# Altium project merged_project.PrjPcb (part 2 of 3)

## Sheet PCB_USB_UART.SchDoc
size A2; SheetNumber: 2; SheetTotal: 3
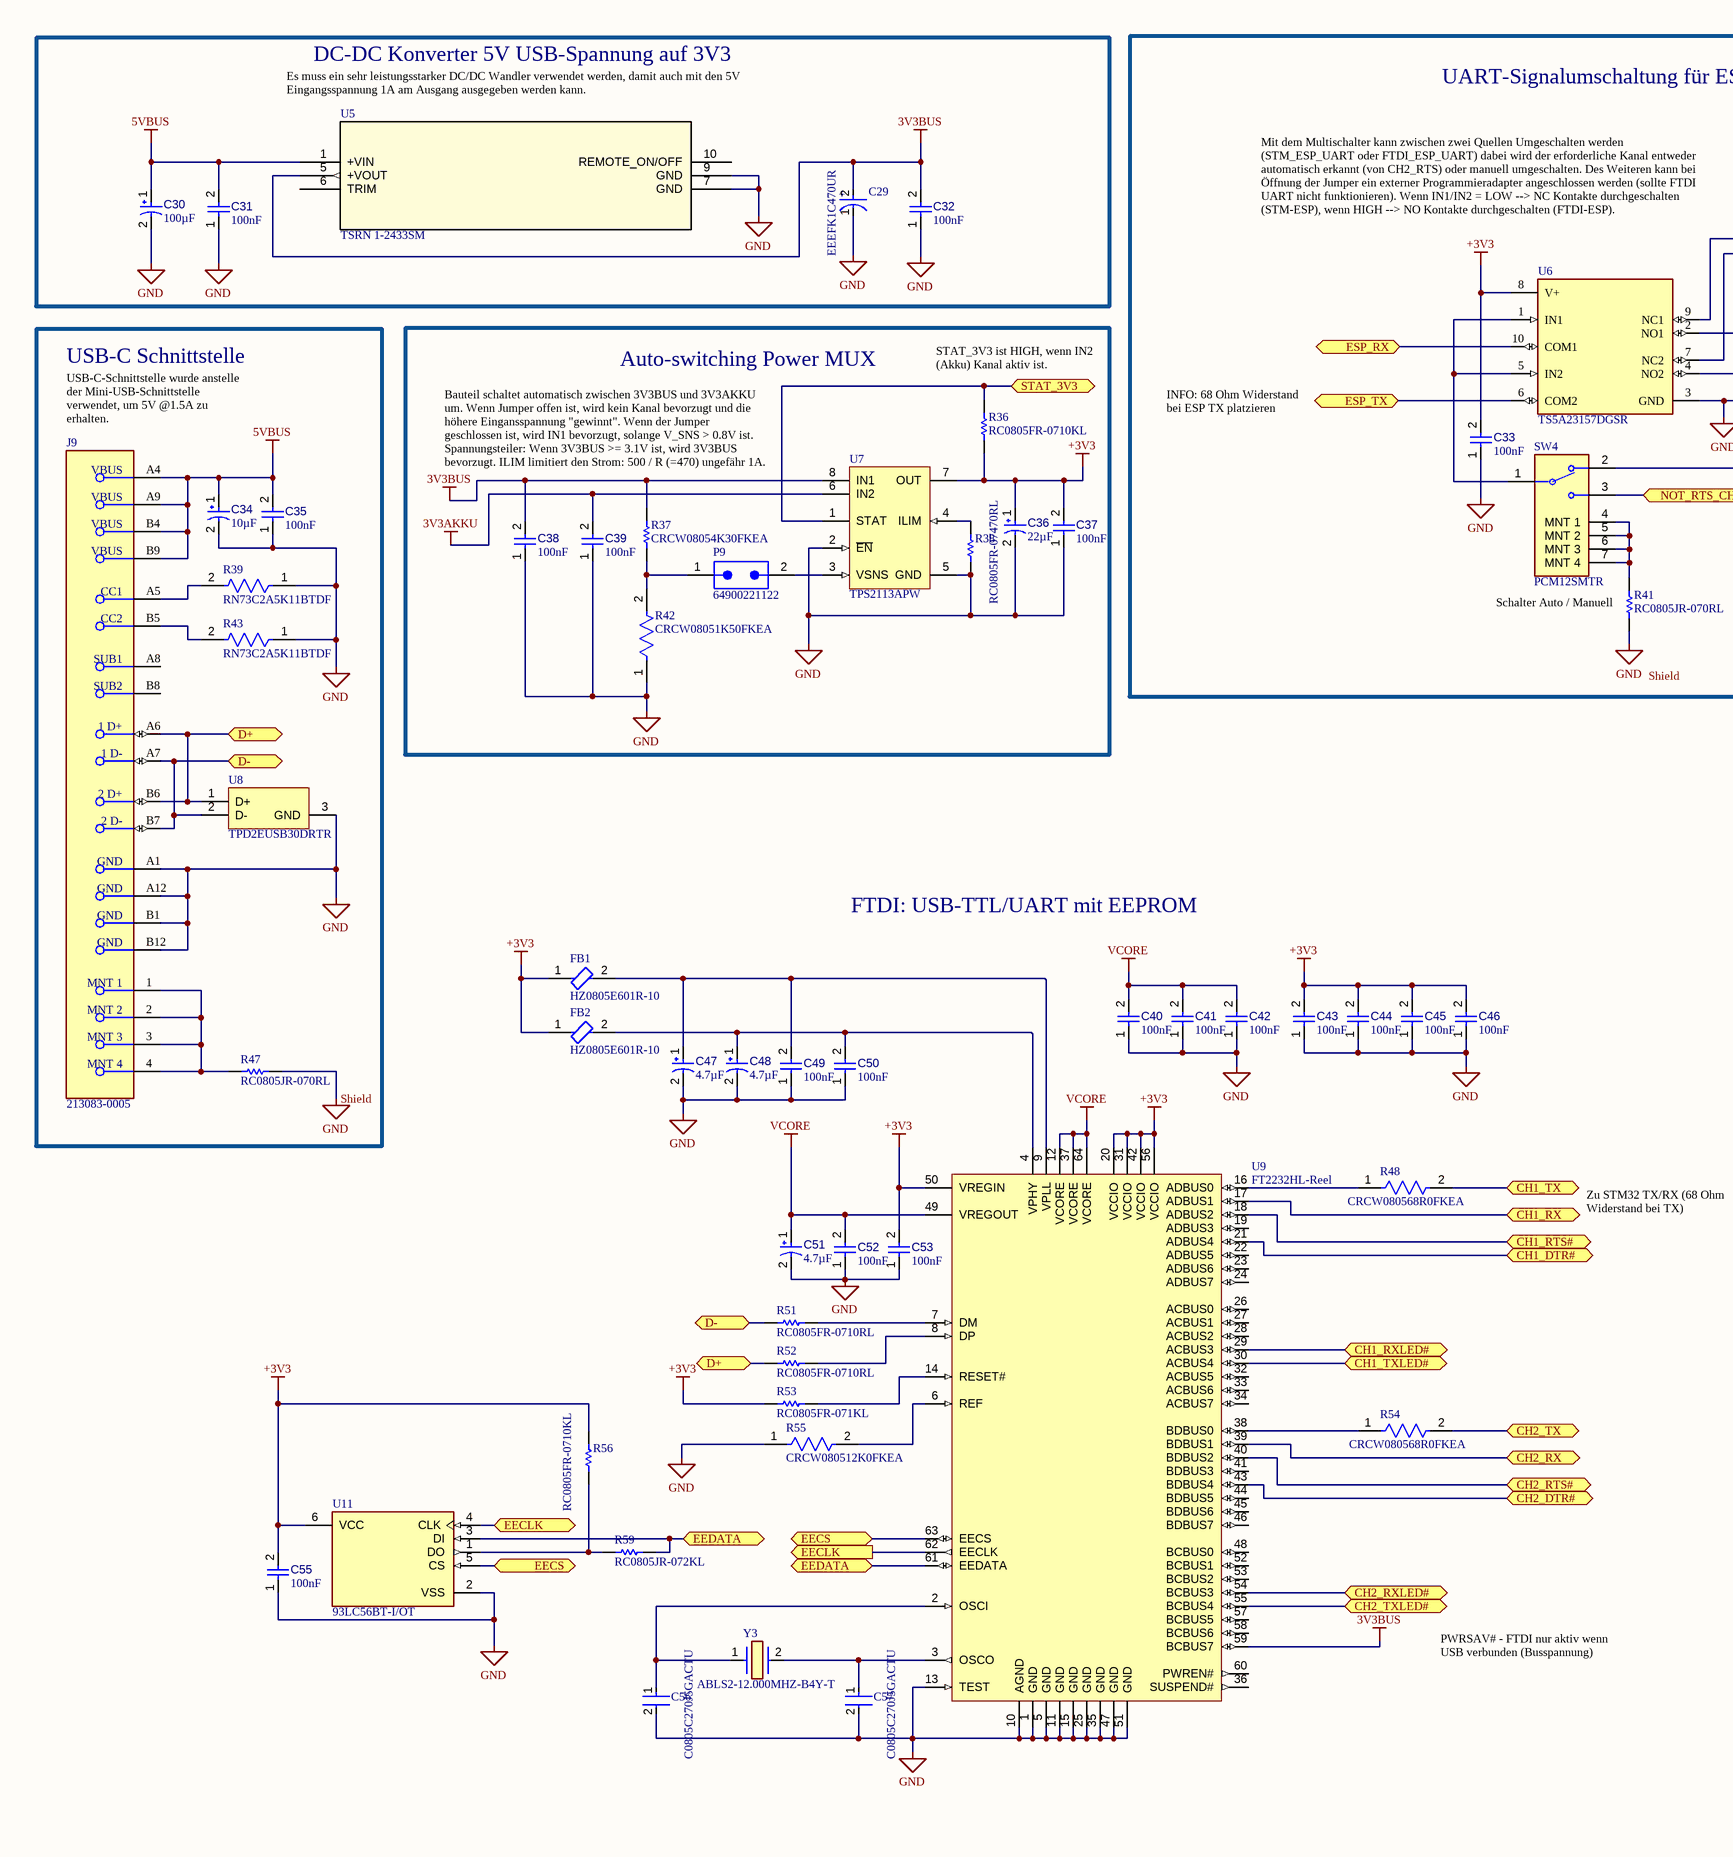
[diagram p2: PCB_USB_UART.SchDoc, left]
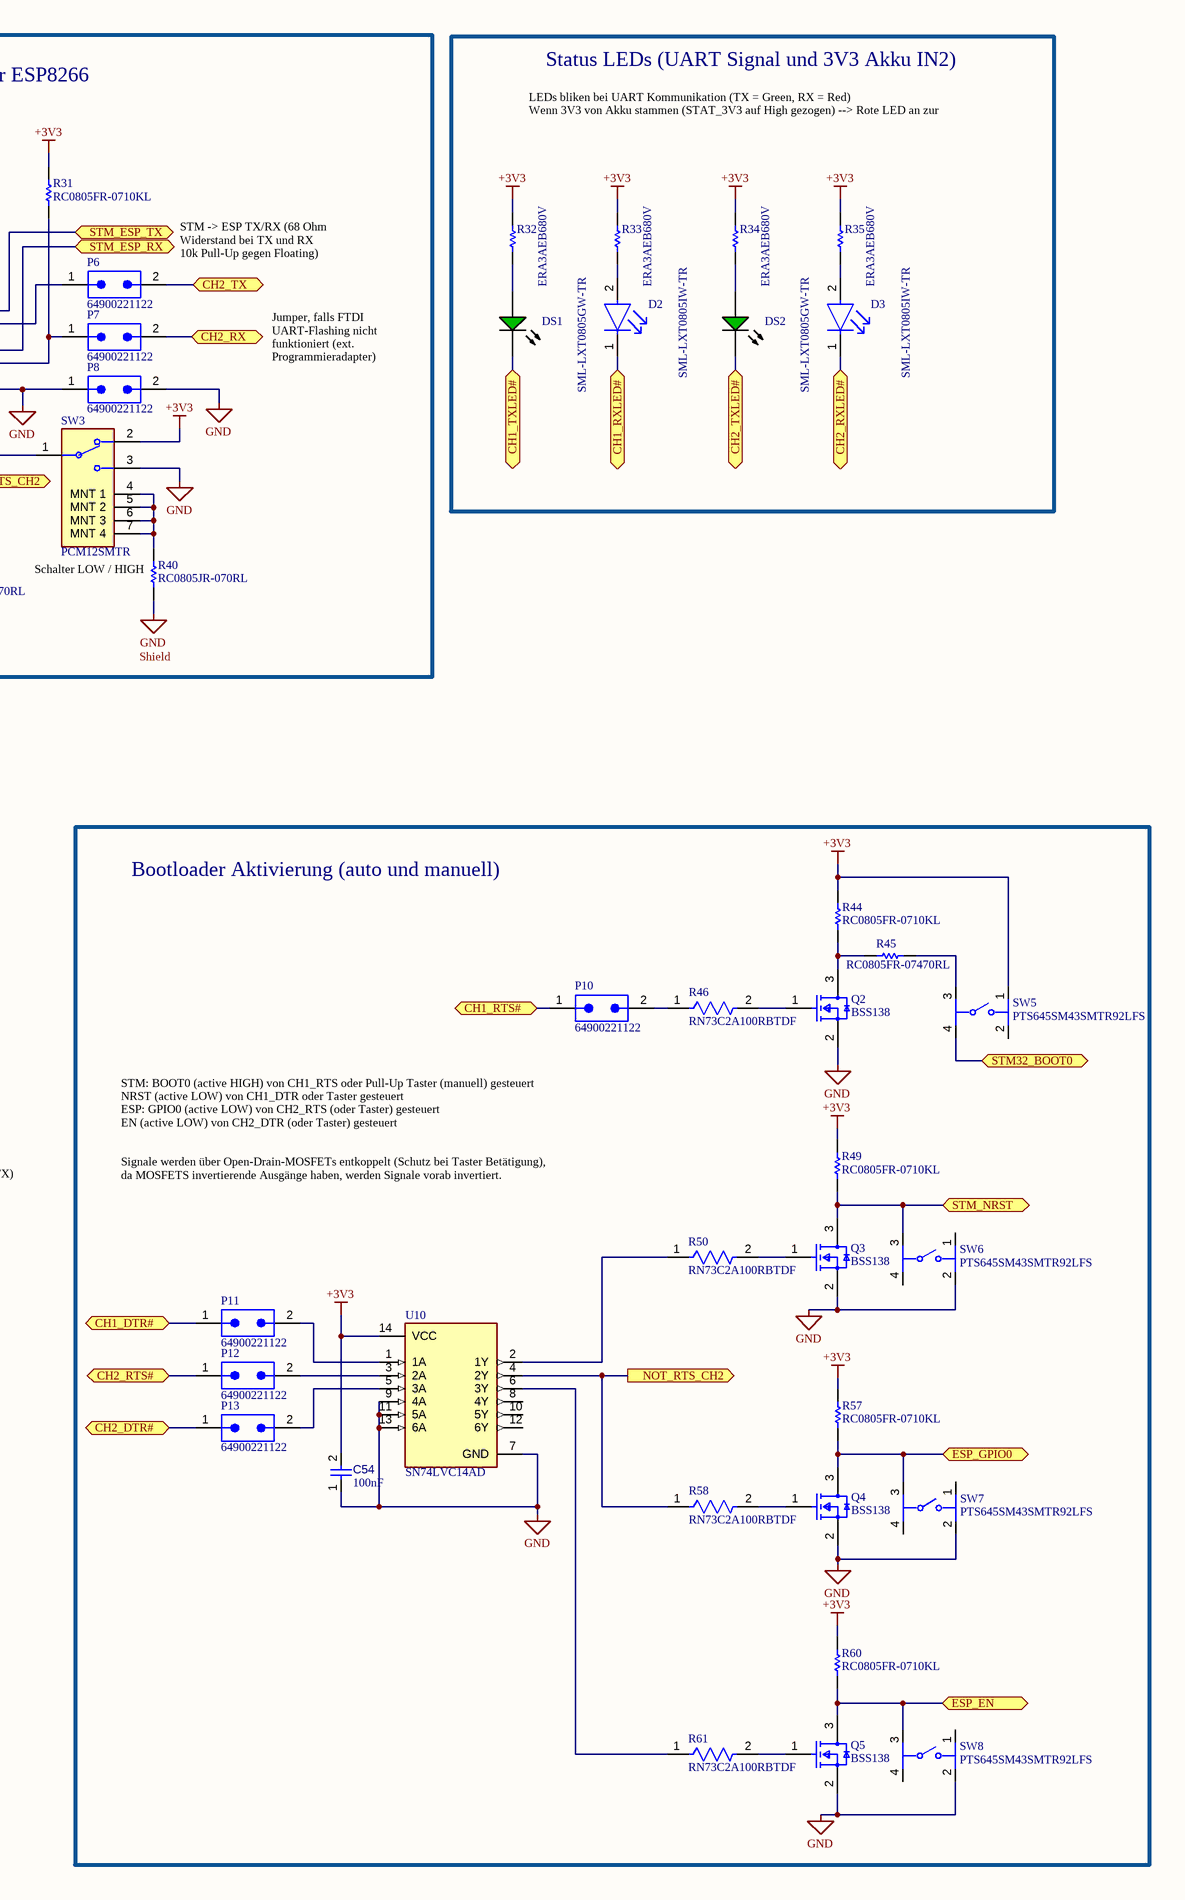
[diagram p3: PCB_USB_UART.SchDoc, right]

### Parts
(Parts that share a designator on the sheet are numbered #1, #2 ... from top to bottom, then left to right.)
C29  EEEFK1C470UR  [FP-FKC-MFG]
C30  value 100µF  [CAPPR65-350-1150X800X1250]  (hidden comment: ECA1HM101)
C31  value 100nF  [CAPC2013X95X50LL10T25]  (hidden comment: Capacitor 100 nF +/-10% 50 V 0805)
C32  value 100nF  [CAPC2013X95X50LL10T25]  (hidden comment: Capacitor 100 nF +/-10% 50 V 0805)
C33  value 100nF  [CAPC2013X95X50LL10T25]  (hidden comment: Capacitor 100 nF +/-10% 50 V 0805)
C34  value 10µF  [CAPPR55-200-1100X500X1200]  (hidden comment: ECA1HM100)
C35  value 100nF  [CAPC2013X95X50LL10T25]  (hidden comment: Capacitor 100 nF +/-10% 50 V 0805)
C36  value 22µF  [CAPPR55-200-1100X500X1200]  (hidden comment: ECA1HM220)
C37  value 100nF  [CAPC2013X95X50LL10T25]  (hidden comment: Capacitor 100 nF +/-10% 50 V 0805)
C38  value 100nF  [CAPC2013X95X50LL10T25]  (hidden comment: Capacitor 100 nF +/-10% 50 V 0805)
C39  value 100nF  [CAPC2013X95X50LL10T25]  (hidden comment: Capacitor 100 nF +/-10% 50 V 0805)
C40  value 100nF  [CAPC2013X95X50LL10T25]  (hidden comment: Capacitor 100 nF +/-10% 50 V 0805)
C41  value 100nF  [CAPC2013X95X50LL10T25]  (hidden comment: Capacitor 100 nF +/-10% 50 V 0805)
C42  value 100nF  [CAPC2013X95X50LL10T25]  (hidden comment: Capacitor 100 nF +/-10% 50 V 0805)
C43  value 100nF  [CAPC2013X95X50LL10T25]  (hidden comment: Capacitor 100 nF +/-10% 50 V 0805)
C44  value 100nF  [CAPC2013X95X50LL10T25]  (hidden comment: Capacitor 100 nF +/-10% 50 V 0805)
C45  value 100nF  [CAPC2013X95X50LL10T25]  (hidden comment: Capacitor 100 nF +/-10% 50 V 0805)
C46  value 100nF  [CAPC2013X95X50LL10T25]  (hidden comment: Capacitor 100 nF +/-10% 50 V 0805)
C47  value 4.7µF  [CAPPR55-200-1100X500X1200]  (hidden comment: ECA1HM4R7)
C48  value 4.7µF  [CAPPR55-200-1100X500X1200]  (hidden comment: ECA1HM4R7)
C49  value 100nF  [CAPC2013X95X50LL10T25]  (hidden comment: Capacitor 100 nF +/-10% 50 V 0805)
C50  value 100nF  [CAPC2013X95X50LL10T25]  (hidden comment: Capacitor 100 nF +/-10% 50 V 0805)
C51  value 4.7µF  [CAPPR55-200-1100X500X1200]  (hidden comment: ECA1HM4R7)
C52  value 100nF  [CAPC2013X95X50LL10T25]  (hidden comment: Capacitor 100 nF +/-10% 50 V 0805)
C53  value 100nF  [CAPC2013X95X50LL10T25]  (hidden comment: Capacitor 100 nF +/-10% 50 V 0805)
C54  value 100nF  [CAPC2013X95X50LL10T25]  (hidden comment: Capacitor 100 nF +/-10% 50 V 0805)
C55  value 100nF  [CAPC2013X95X50LL10T25]  (hidden comment: Capacitor 100 nF +/-10% 50 V 0805)
C56  C0805C270J5GACTU  [FP-C0805C-DN-MFG]
C57  C0805C270J5GACTU  [FP-C0805C-DN-MFG]
D2  SML-LXT0805IW-TR  [FP-SML-LXT0805IW-TR-MFG]
D3  SML-LXT0805IW-TR  [FP-SML-LXT0805IW-TR-MFG]
DS1  SML-LXT0805GW-TR  [LUMX-SML-LXT0805_V]
DS2  SML-LXT0805GW-TR  [LUMX-SML-LXT0805_V]
FB1  HZ0805E601R-10  [FP-HZ0805-MFG]
FB2  HZ0805E601R-10  [FP-HZ0805-MFG]
J9  213083-0005  [FP-2130830005-MFG]
P6  64900221122  [64900221122]
P7  64900221122  [64900221122]
P8  64900221122  [64900221122]
P9  64900221122  [64900221122]
P10#2  64900221122  [64900221122]
P11  64900221122  [64900221122]
P12  64900221122  [64900221122]
P13  64900221122  [64900221122]
Q2  BSS138  [FP-318-08-IPC_B]
Q3  BSS138  [FP-318-08-IPC_B]
Q4  BSS138  [FP-318-08-IPC_B]
Q5  BSS138  [FP-318-08-IPC_B]
R31  RC0805FR-0710KL  [RESC2013X60X35NL10T20]
R32  ERA3AEB680V  [RESC1608X55X30LL20T20]
R33  ERA3AEB680V  [RESC1608X55X30LL20T20]
R34  ERA3AEB680V  [RESC1608X55X30LL20T20]
R35  ERA3AEB680V  [RESC1608X55X30LL20T20]
R36  RC0805FR-0710KL  [RESC2013X60X35NL10T20]
R37  CRCW08054K30FKEA  [RESC2013X50X30LL20T20]
R38  RC0805FR-07470RL  [RESC2013X60X35LL10T20]
R39  RN73C2A5K11BTDF  [FP-RN732A-MFG]
R40  RC0805JR-070RL  [RESC2013X60X35ML10T20]
R41  RC0805JR-070RL  [RESC2013X60X35ML10T20]
R42  CRCW08051K50FKEA  [FP-CRCW0805-e3-MFG]
R43  RN73C2A5K11BTDF  [FP-RN732A-MFG]
R44  RC0805FR-0710KL  [RESC2013X60X35NL10T20]
R45  RC0805FR-07470RL  [RESC2013X60X35LL10T20]
R46  RN73C2A100RBTDF  [FP-RN732A-MFG]
R47  RC0805JR-070RL  [RESC2013X60X35ML10T20]
R48  CRCW080568R0FKEA  [FP-CRCW0805-e3-IPC_C]
R49  RC0805FR-0710KL  [RESC2013X60X35NL10T20]
R50  RN73C2A100RBTDF  [FP-RN732A-MFG]
R51  RC0805FR-0710RL  [RESC2013X60X35ML10T20]
R52  RC0805FR-0710RL  [RESC2013X60X35ML10T20]
R53  RC0805FR-071KL  [RESC2013X60X35ML10T20]
R54  CRCW080568R0FKEA  [FP-CRCW0805-e3-IPC_C]
R55  CRCW080512K0FKEA  [FP-CRCW0805-e3-IPC_A]
R56  RC0805FR-0710KL  [RESC2013X60X35NL10T20]
R57  RC0805FR-0710KL  [RESC2013X60X35NL10T20]
R58  RN73C2A100RBTDF  [FP-RN732A-MFG]
R59  RC0805JR-072KL  [RESC2013X60X35ML10T20]
R60  RC0805FR-0710KL  [RESC2013X60X35NL10T20]
R61  RN73C2A100RBTDF  [FP-RN732A-MFG]
SW3  PCM12SMTR  [FP-PCM12SMTR-MFG]
SW4  PCM12SMTR  [FP-PCM12SMTR-MFG]
SW5  PTS645SM43SMTR92LFS  [FP-PTS645SM43SMTR92LFS-MFG]
SW6  PTS645SM43SMTR92LFS  [FP-PTS645SM43SMTR92LFS-MFG]
SW7  PTS645SM43SMTR92LFS  [FP-PTS645SM43SMTR92LFS-MFG]
SW8  PTS645SM43SMTR92LFS  [FP-PTS645SM43SMTR92LFS-MFG]
U5  TSRN 1-2433SM  [TSR(N]
U6  TS5A23157DGSR  [FP-DGS0010A-IPC_C]
U7  TPS2113APW  [PW0008A_N]
U8  TPD2EUSB30DRTR  [DRT0003A]
U9  FT2232HL-Reel  [LQFP-64_M]
U10  SN74LVC14AD  [FP-D0014A-MFG]
U11  93LC56BT-I/OT  [FP-C04-028-MFG]
Y3  ABLS2-12.000MHZ-B4Y-T  [ABLS]

### Blocks framed on the sheet
DC-DC Konverter 5V USB-Spannung auf 3V3: C29-C32 U5
UART-Signalumschaltung für ESP8266: C33 P6-P8 R31 R40 R41 SW3 SW4 U6
Status LEDs (UART Signal und 3V3 Akku IN2): D2 D3 DS1 DS2 R32-R35
USB-C Schnittstelle: C34 C35 J9 R39 R43 R47 U8
Auto-switching Power MUX: C36-C39 P9 R36-R38 R42 U7
Bootloader Aktivierung (auto und manuell): C54 P10#2 P11-P13 Q2-Q5 R44-R46 R49 R50 R57 R58 R60 R61 SW5-SW8 U10

### Ports
CH1_DTR# (bidir), CH1_RTS# (bidir), CH1_RX (bidir), CH1_RXLED# (bidir), CH1_TX (bidir), CH1_TXLED# (bidir), CH2_DTR# (bidir), CH2_RTS# (bidir), CH2_RX (bidir), CH2_RXLED# (bidir), CH2_TX (bidir), CH2_TXLED# (bidir), D+ (bidir), D- (bidir), EECLK (bidir), EECLK (out), EECS (bidir), EEDATA (bidir), ESP_EN (bidir), ESP_GPIO0 (bidir), ESP_RX (bidir), ESP_TX (bidir), NOT_RTS_CH2 (bidir), NOT_RTS_CH2 (out), STAT_3V3 (bidir), STM32_BOOT0 (bidir), STM_ESP_RX (bidir), STM_ESP_TX (bidir), STM_NRST (bidir)

### Nets
3V3AKKU: C39.2 U7.6(IN2)
3V3BUS: C29.2(A) C32.2 C38.2 R37.2 U5.5(+VOUT) U7.8(IN1) U9.59(BCBUS7)
5VBUS: C30.1 C31.2 C34.1 C35.2 J9.A4(VBUS) J9.A9(VBUS) J9.B4(VBUS) J9.B9(VBUS) U5.1(+VIN)
+3V3: C33.2 C36.1 C37.2 C43.2 C44.2 C45.2 C46.2 C53.2 C54.2 C55.2 FB1.1 FB2.1 R31.2 R32.2 R33.2 R34.2 R35.2 R36.1 R44.2 R49.2 R53.1 R56.2 R57.2 R60.2 SW3.2 SW5.1 U6.8(V+) U7.7(OUT) U9.20(VCCIO) U9.31(VCCIO) U9.42(VCCIO) U9.50(VREGIN) U9.56(VCCIO) U10.14(VCC) U11.6(VCC)
GND: C29.1(C) C30.2 C31.1 C32.1 C33.1 C34.2 C35.1 C36.2 C37.1 C38.1 C39.1 C40.1 C41.1 C42.1 C43.1 C44.1 C45.1 C46.1 C47.2 C48.2 C49.1 C50.1 C51.2 C52.1 C53.1 C54.1 C55.1 C56.2 C57.2 J9.A1(GND) J9.A12(GND) J9.B1(GND) J9.B12(GND) P8.1 P8.2 Q2.2(S) Q3.2(S) Q4.2(S) Q5.2(S) R38.1 R39.1 R40.1 R41.1 R42.1 R43.1 R47.2 R55.1 SW3.3 SW6.2 SW7.2 SW8.2 U5.7(GND) U5.9(GND) U6.3(GND) U7.2(~{EN}) U7.5(GND) U8.3(GND) U9.1(GND) U9.5(GND) U9.10(AGND) U9.11(GND) U9.13(TEST) U9.15(GND) U9.25(GND) U9.35(GND) U9.47(GND) U9.51(GND) U10.7(GND) U10.9(4A) U10.11(5A) U10.13(6A) U11.2(VSS)
VCORE: C40.2 C41.2 C42.2 C51.1 C52.2 U9.12(VCORE) U9.37(VCORE) U9.49(VREGOUT) U9.64(VCORE)
NetC47_1: C47.1 C49.2 FB1.2 U9.9(VPLL)
NetC48_1: C48.1 C50.2 FB2.2 U9.4(VPHY)
NetC56_1: C56.1 U9.2(OSCI) Y3.1
NetC57_1: C57.1 U9.3(OSCO) Y3.2
NetD2_1: D2.1(C) U9.29(ACBUS3) ; port CH1_RXLED#
NetD2_2: D2.2(A) R33.1
NetD3_1: D3.1(C) U9.54(BCBUS3) ; port CH2_RXLED#
NetD3_2: D3.2(A) R35.1
NetDS1_1: DS1.1(A) R32.1
NetDS1_2: DS1.2(K) U9.30(ACBUS4) ; port CH1_TXLED#
NetDS2_1: DS2.1(A) R34.1
NetDS2_2: DS2.2(K) U9.55(BCBUS4) ; port CH2_TXLED#
NetIC2_3: Q5.3(D) R60.1 SW8.3 ; port ESP_EN
NetIC2_4: U6.6(COM2) ; port ESP_TX
NetIC2_5: U6.10(COM1) ; port ESP_RX
NetIC2_6: Q4.3(D) R57.1 SW7.3 ; port ESP_GPIO0
NetIC3_42: R48.2 ; port CH1_TX
NetIC3_60: SW5.4 ; port STM32_BOOT0
NetIC3_61: U6.7(NC2) ; port STM_ESP_RX
NetJ9_1: J9.1(MNT_1) J9.2(MNT_2) J9.3(MNT_3) J9.4(MNT_4) R47.1
NetJ9_A5: J9.A5(CC1) R39.2
NetJ9_A6: J9.A6(1_D+) J9.B6(2_D+) R52.1 U8.1(D+) ; port D+
NetJ9_A7: J9.A7(1_D-) J9.B7(2_D-) R51.1 U8.2(D-) ; port D-
NetJ9_B5: J9.B5(CC2) R43.2
NetP6_1: P6.1 U6.2(NO1)
NetP6_2: P6.2 R54.2 ; port CH2_TX
NetP7_1: P7.1 R31.1 U6.4(NO2)
NetP7_2: P7.2 U9.39(BDBUS1) ; port CH2_RX
NetP9_1: P9.1 R37.1 R42.2
NetP9_2: P9.2 U7.3(VSNS)
NetP10#2_1: P10#2.1 U9.18(ADBUS2) ; port CH1_RTS#
NetP10#2_2: P10#2.2 R46.1
NetP11_1: P11.1 U9.21(ADBUS4) ; port CH1_DTR#
NetP11_2: P11.2 U10.1(1A)
NetP12_1: P12.1 U9.40(BDBUS2) ; port CH2_RTS#
NetP12_2: P12.2 U10.3(2A)
NetP13_1: P13.1 U9.43(BDBUS4) ; port CH2_DTR#
NetP13_2: P13.2 U10.5(3A)
NetQ2_1: Q2.1(G) R46.2
NetQ2_3: Q2.3(D) R44.1 R45.1
NetQ3_1: Q3.1(G) R50.2
NetQ3_3: Q3.3(D) R49.1 SW6.3 ; port STM_NRST
NetQ4_1: Q4.1(G) R58.2
NetQ5_1: Q5.1(G) R61.2
NetR28_2: U6.9(NC1) ; port STM_ESP_TX
NetR29_2: U9.17(ADBUS1) ; port CH1_RX
NetR36_2: R36.2 U7.1(STAT) ; port STAT_3V3
NetR38_2: R38.2 U7.4(ILIM)
NetR40_2: R40.2 SW3.4(MNT_1) SW3.5(MNT_2) SW3.6(MNT_3) SW3.7(MNT_4)
NetR41_2: R41.2 SW4.4(MNT_1) SW4.5(MNT_2) SW4.6(MNT_3) SW4.7(MNT_4)
NetR45_2: R45.2 SW5.3
NetR48_1: R48.1 U9.16(ADBUS0)
NetR50_1: R50.1 U10.2(1Y)
NetR51_2: R51.2 U9.7(DM)
NetR52_2: R52.2 U9.8(DP)
NetR53_2: R53.2 U9.14(RESET#)
NetR54_1: R54.1 U9.38(BDBUS0)
NetR55_2: R55.2 U9.6(REF)
NetR56_1: R56.1 R59.1 U11.1(DO)
NetR58_1: R58.1 SW4.3 U10.4(2Y) ; port NOT_RTS_CH2
NetR59_2: R59.2 U9.61(EEDATA) U11.3(DI) ; port EEDATA
NetR61_1: R61.1 U10.6(3Y)
NetSW3_1: SW3.1 SW4.2
NetSW4_1: SW4.1 U6.1(IN1) U6.5(IN2)
NetU9_62: U9.62(EECLK) U11.4(CLK) ; port EECLK
NetU9_63: U9.63(EECS) U11.5(CS) ; port EECS

Not connected (* = marked no-connect by the designer): J9 A8(SUB1) B8(SUB2); SW5 2; SW6 1 4; SW7 1 4; SW8 1 4; U5 6(TRIM) 10(REMOTE_ON/OFF); U9 19(ADBUS3) 22(ADBUS5) 23(ADBUS6) 24(ADBUS7) 26(ACBUS0) 27(ACBUS1) 28(ACBUS2) 32(ACBUS5) 33(ACBUS6) 34(ACBUS7) 36(SUSPEND#) 41(BDBUS3) 44(BDBUS5) 45(BDBUS6) 46(BDBUS7) 48(BCBUS0) 52(BCBUS1) 53(BCBUS2) 57(BCBUS5) 58(BCBUS6) 60(PWREN#); U10 8(4Y) 10(5Y) 12(6Y)

### Notes on the sheet
- Es muss ein sehr leistungsstarker DC/DC Wandler verwendet werden, damit auch mit den 5V Eingangsspannung 1A am Ausgang ausgegeben werden kann.
- LEDs bliken bei UART Kommunikation (TX = Green, RX = Red)
  Wenn 3V3 von Akku stammen (STAT_3V3 auf High gezogen) --> Rote LED an zur Statusanzeige
- (near R31) Mit dem Multischalter kann zwischen zwei Quellen Umgeschalten werden (STM_ESP_UART oder FTDI_ESP_UART) dabei wird der erforderliche Kanal entweder automatisch erkannt (von CH2_RTS) oder manuell umgeschalten. Des Weiteren kann bei Öffnung der Jumper ein externer Programmieradapter angeschlossen werden (sollte FTDI UART nicht funktionieren). Wenn IN1/IN2 = LOW --> NC Kontakte durchgeschalten (STM-ESP), wenn HIGH --> NO Kontakte durchgeschalten (FTDI-ESP).
- (near P6) STM -> ESP TX/RX (68 Ohm Widerstand bei TX und RX 10k Pull-Up gegen Floating)
- (near R36) STAT_3V3 ist HIGH, wenn IN2 (Akku) Kanal aktiv ist.
- Jumper, falls FTDI UART-Flashing nicht funktioniert (ext. Programmieradapter)
- USB-C-Schnittstelle wurde anstelle der Mini-USB-Schnittstelle verwendet, um 5V @1.5A zu erhalten.
- INFO: 68 Ohm Widerstand bei ESP TX platzieren
- Bauteil schaltet automatisch zwischen 3V3BUS und 3V3AKKU um. Wenn Jumper offen ist, wird kein Kanal bevorzugt und die höhere Eingansspannung "gewinnt". Wenn der Jumper geschlossen ist, wird IN1 bevorzugt, solange V_SNS > 0.8V ist. Spannungsteiler: Wenn 3V3BUS >= 3.1V ist, wird 3V3BUS bevorzugt. ILIM limitiert den Strom: 500 / R (=470) ungefähr 1A.
- (near R40) Schalter LOW / HIGH
- (near R41) Schalter Auto / Manuell
- Shield
- FTDI: USB-TTL/UART mit EEPROM
- Zu STM32 TX/RX (68 Ohm Widerstand bei TX)
- STM: BOOT0 (active HIGH) von CH1_RTS oder Pull-Up Taster (manuell) gesteuert
  NRST (active LOW) von CH1_DTR oder Taster gesteuert
  ESP: GPIO0 (active LOW) von CH2_RTS (oder Taster) gesteuert
  EN (active LOW) von CH2_DTR (oder Taster) gesteuert
  Signale werden über Open-Drain-MOSFETs entkoppelt (Schutz bei Taster Betätigung), da MOSFETS invertierende Ausgänge haben, werden Signale vorab invertiert.
- PWRSAV# - FTDI nur aktiv wenn USB verbunden (Busspannung)
- DWG NO:
- REV:
- THIS DOCUMENT AND THE DATA DISCLOSED HEREIN OR
- HEREWITH IS THE PROPERTY OF ALTIUM LIMITED AND MAY
- BE FREELY DISTRIBUTED IN WHOLE. NO RIGHTS ARE
- RESERVED OR EXPRESS OR IMPLIED WARANTEE GIVEN.
- REVISION
- DESCRIPTION
- DATE
- APPROVED
- ENG:
- APPROVALS
- PROJECT
- DSN:
- CHK:
- REFERENCE DOCUMENTS
- PROJECT REVISION:
- TITLE
- DOCUMENT REVISION:
- DESIGN ITEM:
- BOM:
- FAB DWG:
- PCB DWG:
- ASSY DWG:
- SCALE:
- A2
- SIZE
- CAGE CODE
- FILE NAME
- DWG NO.
- SHEET
- OF
- REV
- (in symbol CMP-05427-002132-1) +

### Library data of the parts
C29 = CMP-05427-002132-1: CAP ALUM 47UF 20% 16V SMD; Dielectric Material: Aluminium; ESR (Equivalent Series Resistance): 700mR; Ripple Current: 160mA; Life (Hours): 2000Hour; Leakage Current: 3uA; Voltage: 10V; Length: 5.8mm; Voltage Rating: 16V; Ratings: AEC-Q200; Package Quantity: 1000; Min Operating Temperature: -55°C; Mount: Surface Mount; Width: 6.5mm; Voltage Rating (DC): 16V; Radiation Hardening: No; Diameter: 5mm; RoHS Compliant: Yes; Reach SVHC Compliant: Yes; Termination: SMD/SMT; Material: Aluminium; Ripple Current (AC): 160mA; Impedance: 700mR; Series: FK; Height - Seated (Max): 0.228inch; Packaging: Tape and Reel; Height: 5.8mm; Capacitance: 47uF; Contact Plating: Tin; Construction: Cylindrical; Number of Pins: 2; Lead Free: Lead Free; Tolerance: 20%; Max Operating Temperature: 105°C; Case/Package: Radial
C30 = CMP-001-00026-7: Aluminum Electrolytic Capacitor, 100 uF, +/- 20%, 50 V, -40 to 85 degC, 2-Pin THD, RoHS, Bulk; Manufacturer: Panasonic; Voltage Rating: 50V; Ripple Current: 250mA; Datasheet URL: https://industrial.panasonic.com/cdbs/www-data/pdf/RDF0000/ABA0000C1218.pdf; Lead Pitch: 3.5mm; Mounting Technology: TH; Package Description: 2-Pin Radial Lead, Dia 8 mm, Height 12.5 mm; Diameter: 8mm; Ripple Current (AC): 250mA; Manufacturer URL: http://www.panasonic.com/; Capacitor Type: Electrolytic; Max Operating Temperature: 85°C; Pins: 2; Min Operating Temperature: -40°C; Tolerance: 20%; Case/Package: Radial; Packaging: Bulk; Package Quantity: 200; Package Reference: CAPPR65-350-1150X800X1250; RoHS Compliant: True; Datasheet Version: Rev. 05, 10/2016
C31-C33 C35 C37-C46 C49 C50 C52-C55 = CMP-001-00018-6: Chip Capacitor, 100 nF, +/- 10%, 50 V, 0805 (2012 Metric); Capacitor Type: Ceramic; Voltage Rating: 50V; Pins: 2; Max Operating Temperature: 125°C; Min Operating Temperature: -55°C; Mounting Technology: SM; Case/Package: 0805; RoHS Compliant: True; Tolerance: 10%
C34 = CMP-001-00025-7: Aluminum Electrolytic Capacitor, 10 uF, +/- 20%, 50 V, -40 to 85 degC, 2-Pin THD, RoHS, Bulk; Manufacturer: Panasonic; Ripple Current (AC): 65mA; Voltage Rating: 50V; Mounting Technology: TH; RoHS Compliant: True; Capacitor Type: Electrolytic; Datasheet Version: Rev. 05, 10/2016; Min Operating Temperature: -40°C; Packaging: Bulk; Ripple Current: 65mA; Tolerance: 20%; Max Operating Temperature: 85°C; Datasheet URL: https://industrial.panasonic.com/cdbs/www-data/pdf/RDF0000/ABA0000C1218.pdf; Lead Pitch: 2mm; Pins: 2; Diameter: 5mm; Manufacturer URL: http://www.panasonic.com/; Package Reference: CAPPR55-200-1100X500X1200; Package Description: 2-Pin Radial Lead, Dia 5 mm, Height 12 mm; Case/Package: Radial; Package Quantity: 200
C36 = CMP-001-00027-7: Aluminum Electrolytic Capacitor, 22 uF, +/- 20%, 50 V, -40 to 85 degC, 2-Pin THD, RoHS, Bulk; Manufacturer: Panasonic; Ripple Current (AC): 100mA; Voltage Rating: 50V; Pins: 2; Case/Package: Radial; Datasheet Version: Rev. 05, 10/2016; RoHS Compliant: True; Max Operating Temperature: 85°C; Ripple Current: 100mA; Capacitor Type: Electrolytic; Mounting Technology: TH; Package Quantity: 200; Package Reference: CAPPR55-200-1100X500X1200; Package Description: 2-Pin Radial Lead, Dia 5 mm, Height 12 mm; Packaging: Bulk; Lead Pitch: 2mm; Min Operating Temperature: -40°C; Diameter: 5mm; Tolerance: 20%; Datasheet URL: https://industrial.panasonic.com/cdbs/www-data/pdf/RDF0000/ABA0000C1218.pdf; Manufacturer URL: http://www.panasonic.com/
C47 C48 C51 = CMP-001-00033-7: Aluminum Electrolytic Capacitor, 4.7 uF, +/- 20%, 50 V, -40 to 85 degC, 2-Pin THD, RoHS, Bulk; Manufacturer: Panasonic; Ripple Current (AC): 45mA; Voltage Rating: 50V; Diameter: 5mm; Min Operating Temperature: -40°C; Lead Pitch: 2mm; Package Quantity: 200; Capacitor Type: Electrolytic; Ripple Current: 45mA; Datasheet Version: Rev. 05, 10/2016; Case/Package: Radial; Pins: 2; Manufacturer URL: http://www.panasonic.com/; RoHS Compliant: True; Package Description: 2-Pin Radial Lead, Dia 5 mm, Height 12 mm; Packaging: Bulk; Datasheet URL: https://industrial.panasonic.com/cdbs/www-data/pdf/RDF0000/ABA0000C1218.pdf; Mounting Technology: TH; Max Operating Temperature: 85°C; Package Reference: CAPPR55-200-1100X500X1200; Tolerance: 20%
C56 C57 = CMP-2007-00597-2: CAP CER 27PF 50V C0G/NP0 0805; Manufacturer: KEMET; Temperature Coefficient: 30ppm/°C; Tolerance: 0.05; Temperature Characteristic: C0G; Material: Ceramic; Device Class L3: Ceramic Capacitors; Voltage Rating: 50 V; Package: C0805C-DN; Height: 0.88mm; Temperature: -55°C to +125°C; Category: Cap; ComponentLink2URL: https://content.kemet.com/datasheets/KEM_C1003_C0G_SMD.pdf; Octopart: https://octopart.com/c0805c270j5gactu-kemet-91046; Mouser Description: Cap Ceramic 27pF 50V C0G 5% SMD 0805 125C Plastic T/R; Temperature Range High: +125°C; RoHS: TRUE; Lead Free: Yes; ComponentLink2Description: Datasheet; Temperature Range Low: -55°C; Digikey Description: CAP CER 27PF 50V C0G/NP0 0805; Manufacturer Part Number: C0805C270J5GACTU; Ipc Land Pattern Name: CAPC200125X78; Automotive: No; Device Class L1: Passive Components; Value: 27 pF; Device Class L2: Capacitors; Capacitance: 27 pF
D2 D3 = CMP-1724-00002-2: LED RED DIFFUSED SMD; Lens Style: Rectangular; Luminous Intensity: 11mcd; Approvals: UL; Test Current: 20mA; Forward Voltage: 2V; Number of LEDs: 1; Wavelength: 635nm; Lens Color: White; Viewing Angle: 140°; Min Operating Temperature: -25°C; Case Code (Metric): 2012; Mount: Surface Mount; Case Code (Imperial): 0805; Height: 0.8mm; Lead Free: Lead Free; Color: Red; Package Quantity: 1; Illumination Color: Red; Lens Transparency: Diffused; Forward Current: 20mA; Packaging: Tape and Reel; Length: 2mm; Case/Package: 0805; REACH SVHC: No SVHC; Width: 1.25mm; Number of Pins: 2; Max Operating Temperature: 80°C; Dominant Wavelength: 635nm
DS1 DS2 = CMP-1724-00001-1: LED, GREEN, 565 nm, 2 V, -25 to 80 degC, 2-Pin SMD, RoHS, Tape and Reel; Case\/Package: 0805; RoHSCompliant: true; REACH SVHC: No SVHC; Packaging: Tape and Reel; ComponentLink2URL: http://www.lumex.com/content/files/ProductAttachment/SML-LXT0805GW-TR.pdf; ComponentLink1URL: http://www.lumexinstruments.com/; Min Operating Temperature: -25 degC; Max Operating Temperature: 85 degC; DatasheetVersion: Rev. F, 09/2009; Case Code (Metric): 2012; Width: 1.25 mm; PackageDescription: 2-Pin Surface Mount Device, Body 2 x 1.25 mm; ComponentLink1Description: Manufacturer URL; Mount: Surface Mount; PackageReference: SML-LXT0805; Length: 2 mm; Case Code (Imperial): 0805; ComponentLink2Description: Datasheet; Package Quantity: 4000; Mounting Technology: Surface Mount
FB1 FB2 = CMP-2000-05194-2: FERRITE BEAD 600 OHM 0805 1LN; Current Rating: 500mA; Frequency: 100MHz; DC Resistance (DCR): 300mR; Number of Lines: 1; Impedance: 600R; Packaging: Tape and Reel; Mount: Surface Mount; Package Quantity: 1; Material: Ferrite; Width: 0.049inch; Min Operating Temperature: -40°C; Core Material: Ferrite; Max Current Rating: 500mA; Case Code (Metric): 2012; Depth: 1.45mm; Case Code (Imperial): 0805; Termination: SMD/SMT; Contact Plating: Tin; Lead Free: Lead Free; Weight: 0.00392oz; Case/Package: 0805; Test Frequency: 100MHz; Length: 2mm; Height: 1.25mm; Max Operating Temperature: 125°C; Max DC Current: 500mA
J9 = CMP-04767-000030-2: CONN RCP USB2.0 TYP C 24P SMD RA; NexarPartId: 114105384; Current Rating: 5A; Number of Contacts: 16; Voltage Rating: 30V; Gender: Receptacle; Min Operating Temperature: -40°C; USB Standard: USB 2.0; Max Operating Temperature: 85°C; Contact Material: Gold, Nickel; Schedule B: 8536695050, 8536695050; Country of Origin: CN
P6-P9 P10#2 P11-P13 = CMP-1502-00493-2: NexarPartId: 8917578; Contact Resistance: 10mΩ; Operating Supply Voltage: 600V; Current Rating: 9A; Gender: Male; Number of Contacts: 2; Lead Length: 3.5mm; Connector Type: Male Pin, Socket; Pitch: 4.2mm; Row Spacing: 5.5118mm; Insulation Resistance: 1GΩ; Height: 12.8mm; Max Operating Temperature: 105°C; Color: White; Number of Rows: 2; Voltage Rating: 600V; Termination: Solder; Fastening Type: Ramp; Width: 5.5mm; Min Operating Temperature: -40°C; Length: 5.4mm; Mount: Through Hole; Flammability Rating: UL94 V-0; Contact Gender: Male; Contact Material: Copper; Lead Pitch: 4.2mm; Housing Material: Nylon; Contact Plating: Tin; Number of Pins: 2; RoHS: Compliant; Orientation: Vertical; REACH SVHC: Unknown; Number of Positions: 2
Q2-Q5 = CMP-07173-000101-1: MOSFET N-CH 50V 220MA SOT-23; Turn-Off Delay Time: 20ns; Element Configuration: Single; Rds On Max: 3.5R; Gate to Source Voltage (Vgs): 20V; Threshold Voltage: 1.3V; Number of Elements: 1; Power Dissipation: 360mW; Rise Time: 9ns; Turn-On Delay Time: 2.5ns; Input Capacitance: 27pF; On-State Resistance: 6R; Lead Free: Lead Free; Length: 2.92mm; Width: 1.3mm; Drain to Source Breakdown Voltage: 50V; Min Operating Temperature: -55°C; REACH SVHC: No SVHC; Packaging: Tape and Reel; Radiation Hardening: No; Height: 0.93mm; Drain to Source Voltage (Vdss): 50V; Current Rating: 220mA; Voltage Rating (DC): 50V; Weight: 0.03g; Continuous Drain Current (ID): 220mA; Number of Pins: 3; Nominal Vgs: 1.3V; Max Power Dissipation: 360mW; Fall Time: 9ns; Drain to Source Resistance: 3.5R; Contact Plating: Tin; Case/Package: SOT-23; Package Quantity: 1; Dual Supply Voltage: 50V; Mount: Surface Mount; Termination: SMD/SMT; Max Operating Temperature: 150°C
R31 R36 R44 R49 R56 R57 R60 = CMP-1659-00013-4: Chip Resistor, 10 KOhm, +/- 1%, 0.125 W, -55 to 155 degC, 0805 (2012 Metric), RoHS, Tape and Reel; Manufacturer: Yageo; Voltage Rating: 150 V; Mount: Surface Mount; ComponentLink1Description: Manufacturer URL; ComponentLink2URL: http://www.yageo.com/documents/recent/PYu-RC_Group_51_RoHS_L_04.pdf; Pins: 2; Length: 2 mm; Min Operating Temperature: -55 degC; Height: 0.5 mm; Mounting Technology: Surface Mount; RoHSCompliant: true; REACH SVHC: No SVHC; ComponentLink1URL: http://www.yageo.com/; Max Operating Temperature: 155 degC; PackageReference: 0805; DatasheetVersion: Rev. 4, 02/2016; Package Quantity: 5000; Packaging: Tape and Reel; ComponentLink2Description: Datasheet; PackageDescription: 2-Pin Surface Mounted Device, Body 2 x 1.25 mm
R32-R35 = CMP-2000-00110-1: Manufacturer: Panasonic; Part Number: ERA3AEB680V
R37 = CMP-2001-03961-1: Manufacturer: Vishay Dale; Part Number: CRCW08054K30FKEA
R38 R45 = CMP-2000-06961-1: Chip Resistor, 470 Ohm, +/- 1%, 125 mW, -55 to 155 degC, 0805 (2012 Metric), RoHS, Tape and Reel; Manufacturer: Yageo; Power Rating: 250mW; Resistor Case Style: 0805[2012Metric]; Voltage Rating: 150V; Resistor Element Type: ThickFilm; Temperature Coefficient: ±100ppm/°C; Resistance: 470ohm; SVHC: ToBeAdvised; Datasheet Version: Rev. 7, 05/2017; Automotive Qualification Standard: -; Mounting Technology: SurfaceMount; Product Range: -; Packaging: Tape&Reel; Package Description: 2-Pin Surface Mounted Device, Body 2 x 1.25 mm; MSL: MSL1-Unlimited; Package Reference: 0805; Resistance Tolerance: ±1%; Datasheet URL: http://www.yageo.com/documents/recent/PYu-RC_Group_51_RoHS_L_7.pdf; Manufacturer URL: http://www.yageo.com/
R39 R43 = CMP-03211-010210-1: SMD Chip Resistor, Thin Film, 5.11KΩ, 100 V, 0805 [2012 Metric], 100 mW, 0.1%, RN73 Series; Manufacturer: TE Connectivity; Voltage Rating: 100V; Temperature Coefficient: 10ppm/°C; Power Rating: 0.1W; Device Class L1: Passive Components; Lead Free: Yes; Device Class L2: Resistors; Series: RN73; ComponentLink2Description: Datasheet; octopart_url: https://octopart.com/rn73c2a5k11btdf-te+connectivity-41219646; Package: RN732A; Category: Res; Value: 5.11KΩ; packaging: 1000 Reel; Resistance: 5.11KΩ; Manufacturer Part Number: RN73C2A5K11BTDF; Composition: Thin Film; Ipc Land Pattern Name: RESC200125X55; Octopart: https://octopart.com/rn73c2a5k11btdf-te+connectivity-41219646; RoHS: TRUE; Temperature: -55°C to 155°C; Height: 0.65mm; Automotive: No; Tolerance: 0.1%; ComponentLink2URL: https://www.te.com/commerce/DocumentDelivery/DDEController?Action=showdoc&DocId=Data+Sheet%7F1773270%7FP%7Fpdf%7FEnglish%7FENG_DS_1773270_P.pdf%7F1676162-2; Temperature Range High: 155°C; Temperature Range Low: -55°C; Device Class L3: Chip SMD Resistors
R40 R41 R47 = CMP-2100-03673-1: Chip Resistor, 0 Ohm, Jumper, +/- 5%, 0.125 W, -55 to 155 degC, 0805 (2012 Metric), RoHS, Tape and Reel; Manufacturer: Yageo; Power Rating: 125mW; Resistance: 0mOhm; Voltage Rating (DC): 150V; Temperature Coefficient: 200ppm/degreesC; Height: 0.5mm; Depth: 1.25mm; Case Code (Imperial): 0805; Lead Free: LeadFree; Military Standard: Not; Package Description: 2-Pin Surface Mounted Device, Body 2 x 1.25 mm; Case Code (Metric): 2012; Composition: ThickFilm; Voltage Rating: 150V; Manufacturer URL: http://www.yageo.com/; Packaging: TapeandReel; Package Reference: 0805; REACH SVHC: Unknown; Tolerance: 5%; Case/Package: 0805; Max Operating Temperature: 155degC; Number of Pins: 2; Min Operating Temperature: -55degC; RoHSCompliant: true; Length: 2mm; Datasheet URL: http://www.yageo.com/NewPortal/yageodocoutput?fileName=/pdf/R-Chip/PYu-RC_Group_51_RoHS_L_5.pdf; Termination: SMD/SMT; Radiation Hardening: No; Width: 1.25mm; Contact Plating: Tin; Datasheet Version: Rev. 5, 10/2016
R42 = CMP-2001-03615-2: RES Thick Film, 1.5kΩ, 1%, 0.125W, 100ppm/°C, 0805; Resistance: 1.5kR; Power Rating: 125mW; Voltage Rating: 150V; Features: Automotive AEC-Q200; Length: 2mm; Min Operating Temperature: -55°C; Width: 0.049inch; Tolerance: 1%; Temperature Coefficient: 100ppm/°C; Case Code (Imperial): 0805; Case Code (Metric): 2012; Package Quantity: 10; Number of Terminations: 2; Max Operating Temperature: 155°C; Military Standard: Not; Height: 0.45mm; Depth: 1.25mm; Lead Free: Lead Free; Packaging: Tape and Reel; Weight: 0.000194oz; Voltage Rating (DC): 150V; Composition: Thick Film; Radiation Hardening: No; Case/Package: 0805; Termination: SMD/SMT; Contact Plating: Tin; Max Power Dissipation: 125mW
R46 R50 R58 R61 = CMP-03211-000756-1: SMD Chip Resistor, Thin Film, 100Ω, 100 V, 0805 [2012 Metric], 100 mW, 0.1%, RN73 Series; Manufacturer: TE Connectivity; Voltage Rating: 100V; Temperature Coefficient: 10ppm/°C; Power Rating: 0.1W; Temperature Range Low: -55°C; Ipc Land Pattern Name: RESC200125X55; Series: RN73; ComponentLink2URL: https://www.te.com/commerce/DocumentDelivery/DDEController?Action=showdoc&DocId=Data+Sheet%7F1773270%7FP%7Fpdf%7FEnglish%7FENG_DS_1773270_P.pdf%7F1676162-2; Composition: Thin Film; Value: 100Ω; Device Class L1: Passive Components; Device Class L3: Chip SMD Resistors; Lead Free: Yes; Octopart: https://octopart.com/rn73c2a100rbtdf-te+connectivity-41188433; Temperature: -55°C to 155°C; packaging: 1000 Reel; Tolerance: 0.1%; Height: 0.65mm; Manufacturer Part Number: RN73C2A100RBTDF; Automotive: No; Temperature Range High: 155°C; Resistance: 100Ω; RoHS: TRUE; Category: Res; octopart_url: https://octopart.com/rn73c2a100rbtdf-te+connectivity-41188433; Package: RN732A; ComponentLink2Description: Datasheet; Device Class L2: Resistors
R48 R54 = CMP-1013-00378-3: RES Thick Film, 68Ω, 1%, 0.125W, 100ppm/°C, 0805; Voltage Rating (DC): 150V; Power Rating: 125mW; Resistance: 68R; Case Code (Metric): 2012; Height: 0.45mm; Depth: 1.25mm; Length: 2mm; Max Power Dissipation: 125mW; Termination: SMD/SMT; Packaging: Tape and Reel; Military Standard: Not; Width: 0.049inch; Radiation Hardening: No; Tolerance: 1%; Package Quantity: 5000; Voltage Rating: 150V; Temperature Coefficient: 100ppm/°C; Number of Terminations: 2; Case Code (Imperial): 0805; Weight: 0.000194oz; Min Operating Temperature: -55°C; Mount: Surface Mount; Case/Package: 0805; Features: Automotive AEC-Q200; Max Operating Temperature: 155°C; Lead Free: Lead Free; Composition: Thick Film; Contact Plating: Tin
R51 R52 = CMP-2100-03670-1: Chip Resistor, 10 Ohm, +/- 1%, 0.125 W, -55 to 155 degC, 0805 (2012 Metric), RoHS, Tape and Reel; Manufacturer: Yageo; Resistance: 10Ohm; Power Rating: 125mW; Voltage Rating: 150V; Temperature Coefficient: 200ppm/degreesC; Number of Pins: 2; REACH SVHC: NoSVHC; Datasheet Version: Rev. 5, 10/2016; Max Operating Temperature: 155degC; Manufacturer URL: http://www.yageo.com/; Case Code (Imperial): 0805; Package Description: 2-Pin Surface Mounted Device, Body 2 x 1.25 mm; Case Code (Metric): 2012; Length: 2mm; RoHSCompliant: true; Max Power Dissipation: 125mW; Depth: 1.25mm; Packaging: TapeandReel; Height: 0.5mm; Package Reference: 0805; Package Quantity: 1; Tolerance: 1%; Termination: SMD/SMT; Min Operating Temperature: -55degC; Lead Free: LeadFree; Width: 1.25mm; Voltage Rating (DC): 150V; Datasheet URL: http://www.yageo.com/NewPortal/yageodocoutput?fileName=/pdf/R-Chip/PYu-RC_Group_51_RoHS_L_5.pdf; Composition: ThickFilm; Number of Terminations: 2; Case/Package: 0805
R53 = CMP-2100-03671-1: Chip Resistor, 1 KOhm, +/- 1%, 125 mW, -55 to 155 degC, 0805 (2012 Metric), RoHS, Tape and Reel; Manufacturer: Yageo; Temperature Coefficient: 100ppm/degreesC; Voltage Rating (DC): 150V; Max Power Dissipation: 125mW; Resistance: 1KOhm; Number of Pins: 2; Number of Terminations: 2; Datasheet URL: http://www.yageo.com/NewPortal/yageodocoutput?fileName=/pdf/R-Chip/PYu-RC_Group_51_RoHS_L_5.pdf; Length: 0.079inch; Package Description: 2-Pin Surface Mounted Device, Body 2 x 1.25 mm; Depth: 1.25mm; Height: 0.024inch; Military Standard: Not; Case/Package: 0805; Package Reference: 0805; RoHSCompliant: true; Lead Free: LeadFree; Packaging: TapeandReel; Package Quantity: 1; Datasheet Version: Rev. 5, 10/2016; Tolerance: 1%; Min Operating Temperature: -55degC; Voltage Rating: 150V; Composition: ThickFilm; Case Code (Imperial): 0805; Power Rating: 125mW; Width: 0.049inch; Case Code (Metric): 2012; Manufacturer URL: http://www.yageo.com/; Max Operating Temperature: 155degC; REACH SVHC: Unknown; Termination: SMD/SMT
R55 = CMP-2001-04934-2: RES Thick Film, 12kΩ, 1%, 0.125W, 100ppm/°C, 0805; Power Rating: 125mW; Voltage Rating (DC): 150V; Resistance: 12kR; Height: 0.45mm; Temperature Coefficient: 100ppm/°C; Min Operating Temperature: -55°C; Case/Package: 0805; Case Code (Imperial): 0805; Contact Plating: Tin; Tolerance: 1%; Weight: 0.000194oz; Max Operating Temperature: 155°C; Features: Automotive AEC-Q200; Mount: Surface Mount; Composition: Thick Film; Max Power Dissipation: 125mW; Number of Terminations: 2; Military Standard: Not; Package Quantity: 10; Width: 0.049inch; Lead Free: Lead Free; Length: 2mm; Depth: 1.25mm; Packaging: Tape and Reel; Radiation Hardening: No; Case Code (Metric): 2012; Voltage Rating: 150V; Termination: SMD/SMT
R59 = CMP-2001-01361-1: Manufacturer: Yageo; Part Number: RC0805JR-072KL
SW3 SW4 = CMP-2000-06884-2: SWITCH SLIDE SPDT 300MA 6V; Actuator Material: Nylon; Switch Function: On-On; Insulation Resistance: 100mR; Actuator Type: Standard; Mechanical Life: 10000Cycles; Actuator Length: 1.5mm; Contact Resistance: 70mR; Min Operating Temperature: -20°C; Max Current Rating: 300mA; Max Voltage Rating (DC): 6V; Package Quantity: 1; Mount: Surface Mount; Packaging: Tape and Reel; Contact Plating: Silver; Depth: 5mm; REACH SVHC: No SVHC; Voltage Rating (DC): 6V; Voltage Rating (AC): 6V; Max Operating Temperature: 85°C; Length: 7.7mm; Termination: Gull Wing; Current Rating: 300mA; Contact Current Rating: 300mA; Orientation: Right Angle; Width: 6.7mm; Switch Travel: 1.5mm; Lead Free: Lead Free; Contact Material: Copper Alloy; Throw Configuration: SPDT
SW5-SW8 = CMP-2000-05160-2: SWITCH TACTILE SPST-NO 0.05A 12V; Contact Resistance: 100mR; Throw Configuration: SPST; Illumination Type: Non-Illuminated; Mechanical Life: 100000Cycles; Current Rating: 50mA; Switch Function: Off-Mom; Actuator Length: 0.85mm; Actuator Material: Nylon; Actuator Type: Standard; Operating Force: 160gf; Min Operating Temperature: -20°C; REACH SVHC: No SVHC; Termination: Gull Wing; Case/Package: SMD/SMT; Packaging: Tape and Reel; Mount: Surface Mount; Voltage Rating (DC): 12V; Orientation: Straight; Lead Free: Lead Free; Contact Material: Silver; Color: Black; Max Current Rating: 50mA; Contact Plating: Silver; Depth: 9mm; Package Quantity: 1; Max Voltage Rating (DC): 12V; Length: 6mm; Max Operating Temperature: 60°C
U5 = CMP-01539-55433846-1: TSRN 1-2433SM Non Isolated Board Mount Dc/dc Converter, Surface Mount Dip, 5.5 W, 1.5 V, 5.5 V, 1 A, 4.6 V Rohs Compliant: Yes; Max Output Current: 1A; Number of Outputs: 1; Min Output Voltage: 1.5V; Max Input Voltage: 42V; Output Power: 5.5W; Min Input Voltage: 4.6V; Output Voltage: 3.3V; Efficiency: 80%; Isolation: Non-Isolated; Max Output Voltage: 5.5V; Width: 9.3mm; Depth: 15.2mm; Output Current: 1A; Length: 15.2mm; Min Operating Temperature: -40°C; Case/Package: SMD/SMT; Number of Pins: 6; Max Input Voltage (DC): 42V; RoHS: Compliant; Max Output Power: 5.5W; NexarPartId: 55433846; Max Operating Temperature: 85°C; Min Input Voltage (DC): 4.6V; Mount: Surface Mount; REACH SVHC: No SVHC; Height: 7mm; Weight: 1.7kg
U6 = CMP-04892-000058-1: IC SWITCH DUAL SPDT 10MSOP; On-State Resistance: 10R; Min Supply Voltage: 1.8V; Max Supply Voltage: 5.5V; Turn-On Delay Time: 5.7ns; Number of Inputs: 2; Operating Supply Current: 1uA; Supply Type: Single; High Level Output Current: 50mA; Turn-Off Delay Time: 3.8ns; Number of Outputs: 4; Bandwidth: 220MHz; Polarity: Non-Inverting; Height: 1.02mm; Contact Plating: Gold; Number of Pins: 10; Length: 3mm; Series: -; Packaging: Tape and Reel; Case/Package: VSSOP; Radiation Hardening: No; Width: 3mm; Number of Channels: 2; Max Operating Temperature: 85°C; Lead Free: Lead Free; Weight: 0.000663oz; Package Quantity: 1; Number of Bits: 2; Low Level Output Current: 50mA; Max Supply Current: 1uA; Throw Configuration: SPDT; Min Operating Temperature: -40°C; Mount: Surface Mount
U7 = CMP-0339-00043-2: Dual In / Single Out Autoswitching Power Mux, 2.8 to 5.5 V, -40 to 85 degC, 8-pin TSSOP (PW), Green (RoHS & no Sb/Br); Manufacturer: Texas Instruments; IN2 Output Current(Max)(A): 1.25; SubFamily: Power Multiplexer (MUX); IN2 rDS(on)(Typ)(Ohms): 0.084; IN1, IN2 Input Voltage(Min)(V): 2.8; IN1 rDS(on)(Typ)(mOhm): 84; IN1, IN2 Input Voltage(Max)(V): 5.5; Number of Inputs: 2; Mounting Technology: Surface Mount; Code_JEDEC: MO-153; IN1 Output Current(Max)(A): 1.25; DatasheetVersion: SBVS045C; ComponentLink1Description: Datasheet; PackageVersion: revG, Feb-2011; Eco-Plan: Green (RoHS & no Sb/Br); ComponentLink1URL: http://www.ti.com/general/docs/lit/getliterature.tsp?genericPartNumber=TPS2113A&fileType=pdf; PackageDescription: 8-Pin Plastic Thin Small Outline Package 3 x 4.4 mm Body ,0.65 mm Pitch; PackageReference: PW0008A; PartNumber: TPS2113APW
U8 = CMP-0326-00046-3: ESD Solution for Super-Speed (6 Gbps) USB 3.0 Interface, 2 Channels, -40 to +85 degC, 3-pin SOT (DRT), Green (Rohs & No Sb/Br); Manufacturer: Texas Instruments; Differential Capacitance(pF): 0.01; Breakdown Voltage(Min)(V): 9; HDMI: TRUE; IEC 61000-4-2 Air-Gap(+/- kV): 8; IO Leakage Current(nA): 10; IO Capacitance(Typ)(pF): 0.7; Mounting Technology: Surface Mount; PackageDescription: 3-Flat Lead Plastic Small Outline, 1 x 1 mm (inc leads), 0.35 mm Pitch; IEC 61000-4-2 Contact(+/- kV): 8; USB Super Speed: TRUE; Eco-Plan: Green (RoHS & no Sb/Br); USB High Speed: TRUE; PackageReference: DRT0003A; SubFamily: ESD Solution; USB Full Speed: TRUE; ComponentLink1Description: Datasheet; ComponentLink2URL: SamplesURL:http://www.ti.com/product/tpd2eusb30#samples; PackageVersion: revD, Jun-2008; ComponentLink2Description: URL Link1; 1394 / Firewire: TRUE; PartNumber: TPD2EUSB30DRTR; ComponentLink1URL: http://www.ti.com/general/docs/lit/getliterature.tsp?genericPartNumber=TPD2EUSB30&fileType=pdf; DatasheetVersion: SLVSAC2C; Serial ATA / eSATA: TRUE
U9 = CMP-0078-00023-3: Dual High Speed USB To Multipurpose UART/FIFO IC, 64-pin LQFP, Tape and Reel; Manufacturer: FTDI; DatasheetVersion: ver 2.21, Jun-2012; ComponentLink1URL: http://www.ftdichip.com/; PartNumber: FT2232HL-Reel; ComponentLink2Description: Datasheet; RevisionNote: DatasheetVersion updated to 2.21 Jun-2012; PackageVersion: Jun-12; ComponentLink1Description: Manufacturer URL; ComponentLink2URL: http://www.ftdichip.com/Support/Documents/DataSheets/ICs/DS_FT2232H.pdf; PackageReference: LQFP-64; PackageDescription: 64-Pin Thin Quad Flat Pack, 10 x 10 x 1.4 mm Body, 0.5 mm Pitch
U10 = CMP-1615-00149-4: IC INVERTER SCHMITT 6CH 14SOIC; Manufacturer: TEXAS INSTRUMENTS; Number Of Inputs: 1; Number Of Circuits: 6; Standoff Height: 0.1mm; Max Supply Voltage: 3.6V; Min Supply Voltage: 1.65V; Logic Function Desc: Inverting; Propagation Delay: 3.2ns; Nominal Supply Current: 1uA; Device Class L1: Integrated Circuits (ICs); Package: D0014A; Device Class L3: Logic Gates; Manufacturer Part Number: SN74LVC14AD; RoHS: TRUE; Digikey Description: IC INVERTER SCHMITT 6CH 14SOIC; Octopart: https://octopart.com/sn74lvc14ad-texas+instruments-22854; Number Of Outputs: 1; Temperature Range High: +125°C; ComponentLink2Description: Datasheet; Category: IC; Height: 1.75mm; Automotive: No; Mouser Description: In a Pack of 10, Texas Instruments SN74LVC14AD, Hex Schmitt Trigger CMOS Inverter, 14-Pin SOIC; Temperature Range Low: -40°C; Device Class L2: Logic ICs; Lead Free: Yes; Temperature: -40°C to +125°C; ComponentLink2URL: https://www.ti.com/lit/gpn/SN74LVC14A
U11 = CMP-0162-00356-2: IC EEPROM 2K SPI 2MHZ SOT23-6; Access Time: 250ns; Density: 2Kb; Max Supply Voltage: 5.5V; Interface: Serial; Min Supply Voltage: 2.5V; Nominal Supply Current: 2mA; Number of Pins: 6; Radiation Hardening: No; Length: 3.1mm; Height: 1.3mm; Min Operating Temperature: -40°C; Max Operating Temperature: 85°C; Lead Free: Lead Free; Memory Type: EEPROM; Contact Plating: Tin; REACH SVHC: No SVHC; Package Quantity: 3000; Frequency: 2MHz; Width: 1.8mm; Max Frequency: 2MHz; Case/Package: SOT-23; Mount: Surface Mount; Packaging: Tape and Reel; Memory Size: 2Kb
Y3 = ABLS2-12.000MHZ-B4Y-T: Crystal or Oscillator; Manufacturer_Name: ABRACON; Datasheet Link: https://abracon.com/Resonators/abls.pdf; Manufacturer_Part_Number: ABLS2-12.000MHZ-B4Y-T; Mouser Part Number: 815-ABLS2-12-B4YT; Mouser Price/Stock: https://www.mouser.co.uk/ProductDetail/ABRACON/ABLS2-12000MHZ-B4Y-T?qs=DZ%2FvJMgWWIs6Scm%252BixQ6gw%3D%3D